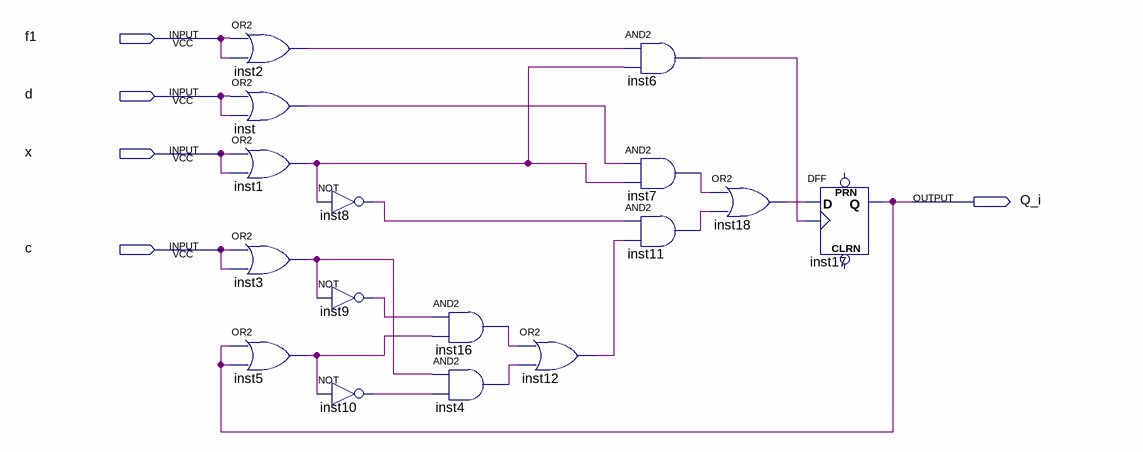
[diagram p0: schematic sheet]
// Quartus schematic cr_i.bdf as structural Verilog: 16 symbols, 5 pins
module cr_i (
  input  f1,
  input  d,
  input  x,
  input  c,
  output Q_i
);

  wire inst1_out, inst2_out, inst3_out, inst4_out, inst5_out, inst6_out, inst7_out, inst8_out, inst9_out,
       inst10_out, inst11_out, inst12_out, inst16_out, inst18_out, inst_out;

  or inst2 (inst2_out, f1, f1);
  or inst (inst_out, d, d);
  or inst1 (inst1_out, x, x);
  or inst3 (inst3_out, c, c);
  or inst5 (inst5_out, Q_i, Q_i);
  not inst8 (inst8_out, inst1_out);
  not inst9 (inst9_out, inst3_out);
  not inst10 (inst10_out, inst5_out);
  and inst16 (inst16_out, inst9_out, inst5_out);
  and inst4 (inst4_out, inst3_out, inst10_out);
  or inst12 (inst12_out, inst16_out, inst4_out);
  and inst6 (inst6_out, inst2_out, inst1_out);
  and inst7 (inst7_out, inst_out, inst1_out);
  and inst11 (inst11_out, inst8_out, inst12_out);
  or inst18 (inst18_out, inst7_out, inst11_out);
  DFF inst17 (.CLK(inst6_out), .D(inst18_out), .Q(Q_i));  // open: CLRN, PRN
endmodule
